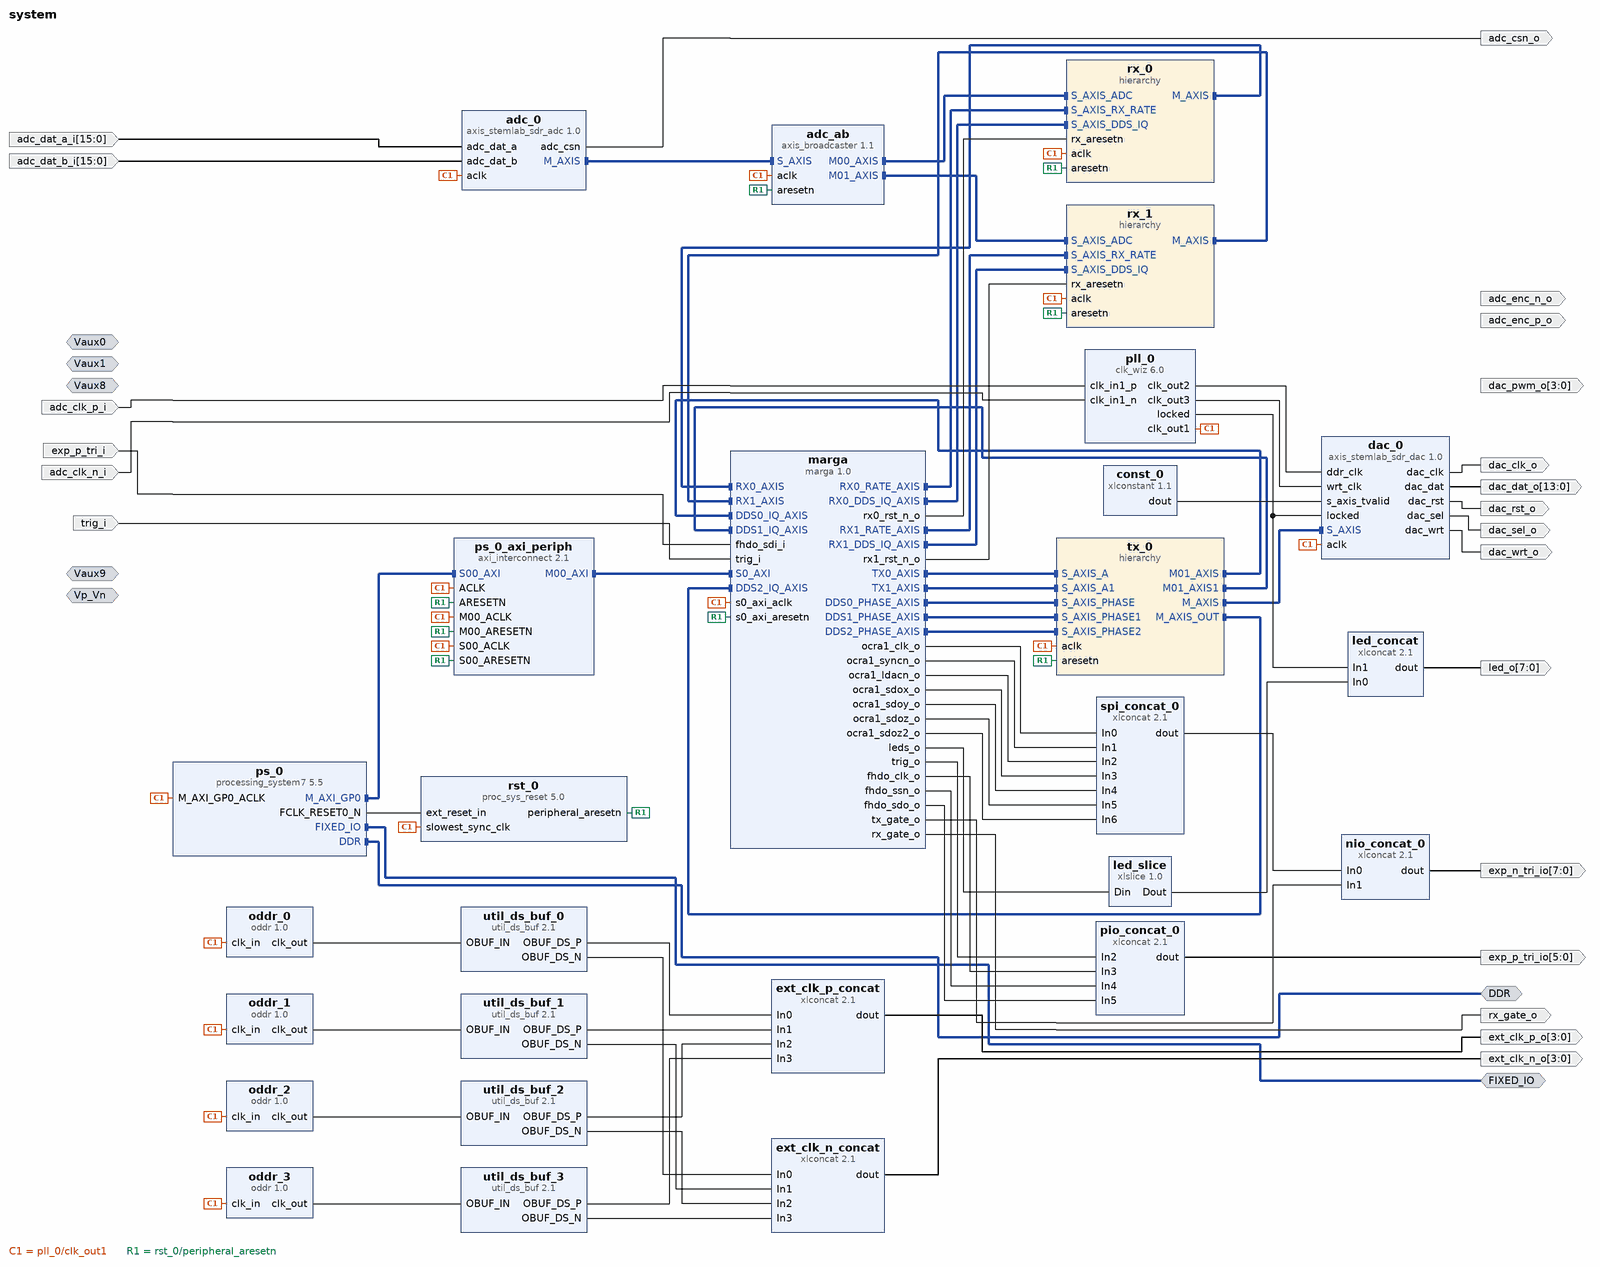
[diagram p0: block diagram of the top level]
# Vivado block design system, xc7z020clg400-1, Vivado 2020.2
create_bd_design system

create_bd_intf_port -mode Slave -vlnv xilinx.com:interface:diff_analog_io_rtl:1.0 Vp_Vn
create_bd_intf_port -mode Slave -vlnv xilinx.com:interface:diff_analog_io_rtl:1.0 Vaux0
create_bd_intf_port -mode Slave -vlnv xilinx.com:interface:diff_analog_io_rtl:1.0 Vaux1
create_bd_intf_port -mode Slave -vlnv xilinx.com:interface:diff_analog_io_rtl:1.0 Vaux9
create_bd_intf_port -mode Slave -vlnv xilinx.com:interface:diff_analog_io_rtl:1.0 Vaux8
create_bd_intf_port -mode Master -vlnv xilinx.com:interface:ddrx_rtl:1.0 DDR
create_bd_intf_port -mode Master -vlnv xilinx.com:display_processing_system7:fixedio_rtl:1.0 FIXED_IO
create_bd_port -dir I -from 15 -to 0 adc_dat_a_i
create_bd_port -dir I -from 15 -to 0 adc_dat_b_i
create_bd_port -dir I adc_clk_p_i
create_bd_port -dir I adc_clk_n_i
create_bd_port -dir O adc_enc_p_o
create_bd_port -dir O adc_enc_n_o
create_bd_port -dir O adc_csn_o
create_bd_port -dir O -from 13 -to 0 dac_dat_o
create_bd_port -dir O dac_clk_o
create_bd_port -dir O dac_rst_o
create_bd_port -dir O dac_sel_o
create_bd_port -dir O dac_wrt_o
create_bd_port -dir O -from 3 -to 0 dac_pwm_o
create_bd_port -dir O -from 5 -to 0 exp_p_tri_io
create_bd_port -dir I -type data exp_p_tri_i
create_bd_port -dir O -type data rx_gate_o
create_bd_port -dir O -from 7 -to 0 exp_n_tri_io
create_bd_port -dir I -type data trig_i
create_bd_port -dir O -from 7 -to 0 led_o
create_bd_port -dir O -from 3 -to 0 -type clk ext_clk_p_o
create_bd_port -dir O -from 3 -to 0 -type clk ext_clk_n_o

create_bd_cell -type ip -vlnv xilinx.com:ip:clk_wiz:6.0 pll_0
set_property -dict [list \
  CONFIG.CLKOUT1_REQUESTED_OUT_FREQ 122.88 \
  CONFIG.CLKOUT1_USED true \
  CONFIG.CLKOUT2_REQUESTED_OUT_FREQ 245.76 \
  CONFIG.CLKOUT2_REQUESTED_PHASE -112.5 \
  CONFIG.CLKOUT2_USED true \
  CONFIG.CLKOUT3_REQUESTED_OUT_FREQ 245.76 \
  CONFIG.CLKOUT3_REQUESTED_PHASE -67.5 \
  CONFIG.CLKOUT3_USED true \
  CONFIG.PRIMITIVE PLL \
  CONFIG.PRIM_IN_FREQ 122.88 \
  CONFIG.PRIM_SOURCE Differential_clock_capable_pin \
  CONFIG.USE_RESET false \
] [get_bd_cells pll_0]
create_bd_cell -type ip -vlnv xilinx.com:ip:oddr:1.0 oddr_0
create_bd_cell -type ip -vlnv xilinx.com:ip:oddr:1.0 oddr_1
create_bd_cell -type ip -vlnv xilinx.com:ip:oddr:1.0 oddr_2
create_bd_cell -type ip -vlnv xilinx.com:ip:oddr:1.0 oddr_3
create_bd_cell -type ip -vlnv xilinx.com:ip:util_ds_buf:2.1 util_ds_buf_0
set_property -dict {CONFIG.C_BUF_TYPE OBUFDS} [get_bd_cells util_ds_buf_0]
create_bd_cell -type ip -vlnv xilinx.com:ip:util_ds_buf:2.1 util_ds_buf_1
set_property -dict {CONFIG.C_BUF_TYPE OBUFDS} [get_bd_cells util_ds_buf_1]
create_bd_cell -type ip -vlnv xilinx.com:ip:util_ds_buf:2.1 util_ds_buf_2
set_property -dict {CONFIG.C_BUF_TYPE OBUFDS} [get_bd_cells util_ds_buf_2]
create_bd_cell -type ip -vlnv xilinx.com:ip:util_ds_buf:2.1 util_ds_buf_3
set_property -dict {CONFIG.C_BUF_TYPE OBUFDS} [get_bd_cells util_ds_buf_3]
create_bd_cell -type ip -vlnv xilinx.com:ip:xlconcat:2.1 ext_clk_p_concat
set_property -dict {CONFIG.NUM_PORTS 4} [get_bd_cells ext_clk_p_concat]
create_bd_cell -type ip -vlnv xilinx.com:ip:xlconcat:2.1 ext_clk_n_concat
set_property -dict {CONFIG.NUM_PORTS 4} [get_bd_cells ext_clk_n_concat]
create_bd_cell -type ip -vlnv xilinx.com:ip:processing_system7:5.5 ps_0
set_property -dict [list \
  CONFIG.PCW_APU_PERIPHERAL_FREQMHZ 666.666666 \
  CONFIG.PCW_ENET0_ENET0_IO {MIO 16 .. 27} \
  CONFIG.PCW_ENET0_GRP_MDIO_ENABLE 1 \
  CONFIG.PCW_ENET0_GRP_MDIO_IO {MIO 52 .. 53} \
  CONFIG.PCW_ENET0_PERIPHERAL_ENABLE 1 \
  CONFIG.PCW_ENET0_RESET_ENABLE 0 \
  CONFIG.PCW_ENET_RESET_ENABLE 1 \
  CONFIG.PCW_ENET_RESET_SELECT {Share reset pin} \
  CONFIG.PCW_FPGA0_PERIPHERAL_FREQMHZ 143 \
  CONFIG.PCW_FPGA1_PERIPHERAL_FREQMHZ 50 \
  CONFIG.PCW_GPIO_EMIO_GPIO_ENABLE 1 \
  CONFIG.PCW_GPIO_EMIO_GPIO_IO 64 \
  CONFIG.PCW_GPIO_MIO_GPIO_ENABLE 1 \
  CONFIG.PCW_GPIO_MIO_GPIO_IO MIO \
  CONFIG.PCW_GPIO_PERIPHERAL_ENABLE 1 \
  CONFIG.PCW_I2C0_GRP_INT_ENABLE 0 \
  CONFIG.PCW_I2C0_I2C0_IO {MIO 50 .. 51} \
  CONFIG.PCW_I2C0_PERIPHERAL_ENABLE 1 \
  CONFIG.PCW_I2C_PERIPHERAL_FREQMHZ 111.111115 \
  CONFIG.PCW_I2C_RESET_ENABLE 1 \
  CONFIG.PCW_I2C_RESET_SELECT {Share reset pin} \
  CONFIG.PCW_IMPORT_BOARD_PRESET cfg/stemlab_sdr.xml \
  CONFIG.PCW_PRESET_BANK1_VOLTAGE {LVCMOS 2.5V} \
  CONFIG.PCW_QSPI_GRP_SINGLE_SS_ENABLE 1 \
  CONFIG.PCW_QSPI_GRP_SINGLE_SS_IO {MIO 1 .. 6} \
  CONFIG.PCW_QSPI_PERIPHERAL_ENABLE 1 \
  CONFIG.PCW_QSPI_PERIPHERAL_FREQMHZ 125 \
  CONFIG.PCW_QSPI_QSPI_IO {MIO 1 .. 6} \
  CONFIG.PCW_SD0_GRP_CD_ENABLE 1 \
  CONFIG.PCW_SD0_GRP_CD_IO {MIO 46} \
  CONFIG.PCW_SD0_GRP_WP_ENABLE 1 \
  CONFIG.PCW_SD0_GRP_WP_IO {MIO 47} \
  CONFIG.PCW_SD0_PERIPHERAL_ENABLE 1 \
  CONFIG.PCW_SD0_SD0_IO {MIO 40 .. 45} \
  CONFIG.PCW_SDIO_PERIPHERAL_FREQMHZ 100 \
  CONFIG.PCW_SINGLE_QSPI_DATA_MODE x4 \
  CONFIG.PCW_SPI0_PERIPHERAL_ENABLE 1 \
  CONFIG.PCW_SPI0_SPI0_IO EMIO \
  CONFIG.PCW_SPI1_PERIPHERAL_ENABLE 1 \
  CONFIG.PCW_SPI1_SPI1_IO {MIO 10 .. 15} \
  CONFIG.PCW_TTC0_PERIPHERAL_ENABLE 1 \
  CONFIG.PCW_TTC0_TTC0_IO EMIO \
  CONFIG.PCW_UART0_PERIPHERAL_ENABLE 1 \
  CONFIG.PCW_UART0_UART0_IO {MIO 14 .. 15} \
  CONFIG.PCW_UART1_PERIPHERAL_ENABLE 1 \
  CONFIG.PCW_UART1_UART1_IO {MIO 8 .. 9} \
  CONFIG.PCW_UART_PERIPHERAL_FREQMHZ 100 \
  CONFIG.PCW_UIPARAM_DDR_BUS_WIDTH {16 Bit} \
  CONFIG.PCW_UIPARAM_DDR_FREQ_MHZ 533.333333 \
  CONFIG.PCW_UIPARAM_DDR_PARTNO {MT41J256M16 RE-125} \
  CONFIG.PCW_USB0_PERIPHERAL_ENABLE 1 \
  CONFIG.PCW_USB0_RESET_ENABLE 1 \
  CONFIG.PCW_USB0_RESET_IO {MIO 48} \
  CONFIG.PCW_USB0_USB0_IO {MIO 28 .. 39} \
  CONFIG.PCW_USB_RESET_ENABLE 1 \
  CONFIG.PCW_USB_RESET_SELECT {Share reset pin} \
] [get_bd_cells ps_0]
# 430 more settings of ps_0 are not shown: defaults, MIO pin electricals, DDR timing, and values the tool derives
create_bd_cell -type ip -vlnv xilinx.com:ip:proc_sys_reset:5.0 rst_0
create_bd_cell -type ip -vlnv xilinx.com:ip:xlconstant:1.1 const_0
create_bd_cell -type ip -vlnv pavel-demin:user:axis_stemlab_sdr_adc:1.0 adc_0
set_property -dict {CONFIG.ADC_DATA_WIDTH 16} [get_bd_cells adc_0]
create_bd_cell -type ip -vlnv pavel-demin:user:axis_stemlab_sdr_dac:1.0 dac_0
set_property -dict {CONFIG.DAC_DATA_WIDTH 14} [get_bd_cells dac_0]
create_bd_cell -type ip -vlnv xilinx.com:ip:axis_broadcaster:1.1 adc_ab
set_property -dict [list \
  CONFIG.HAS_TREADY 0 \
  CONFIG.M00_TDATA_REMAP {tdata[15:0]} \
  CONFIG.M01_TDATA_REMAP {tdata[31:16]} \
  CONFIG.M_TDATA_NUM_BYTES 2 \
  CONFIG.S_TDATA_NUM_BYTES 4 \
] [get_bd_cells adc_ab]
create_bd_cell -type ip -vlnv open-mri:user:marga:1.0 marga
set_property -dict {CONFIG.C_S0_AXI_ADDR_WIDTH 19 CONFIG.RX_FIFO_LENGTH 16384} [get_bd_cells marga]
create_bd_cell -type ip -vlnv xilinx.com:ip:axi_interconnect:2.1 ps_0_axi_periph
set_property -dict {CONFIG.NUM_MI 1} [get_bd_cells ps_0_axi_periph]
create_bd_cell -type hier rx_0
create_bd_cell -type hier rx_1
create_bd_cell -type hier tx_0
create_bd_cell -type ip -vlnv xilinx.com:ip:xlslice:1.0 led_slice
set_property -dict {CONFIG.DIN_FROM 6 CONFIG.DIN_TO 0 CONFIG.DIN_WIDTH 8} [get_bd_cells led_slice]
create_bd_cell -type ip -vlnv xilinx.com:ip:xlconcat:2.1 led_concat
set_property -dict {CONFIG.IN0_WIDTH 7 CONFIG.IN1_WIDTH 1 CONFIG.NUM_PORTS 2} [get_bd_cells led_concat]
create_bd_cell -type ip -vlnv xilinx.com:ip:xlconcat:2.1 spi_concat_0
set_property -dict {CONFIG.NUM_PORTS 7} [get_bd_cells spi_concat_0]
create_bd_cell -type ip -vlnv xilinx.com:ip:xlconcat:2.1 pio_concat_0
set_property -dict {CONFIG.NUM_PORTS 6} [get_bd_cells pio_concat_0]
create_bd_cell -type ip -vlnv xilinx.com:ip:xlconcat:2.1 nio_concat_0
set_property -dict {CONFIG.NUM_PORTS 2} [get_bd_cells nio_concat_0]

# ---- hierarchy /rx_0 ----
current_bd_instance /rx_0
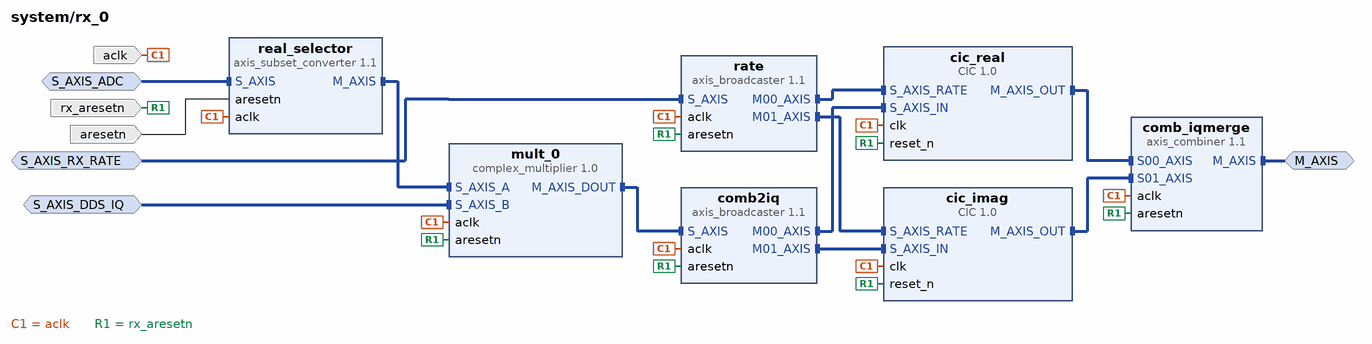
[diagram p1: block diagram inside /rx_0]
create_bd_intf_pin -mode Slave -vlnv xilinx.com:interface:axis_rtl:1.0 S_AXIS_ADC
create_bd_intf_pin -mode Slave -vlnv xilinx.com:interface:axis_rtl:1.0 S_AXIS_DDS_IQ
create_bd_intf_pin -mode Slave -vlnv xilinx.com:interface:axis_rtl:1.0 S_AXIS_RX_RATE
create_bd_intf_pin -mode Master -vlnv xilinx.com:interface:axis_rtl:1.0 M_AXIS
create_bd_pin -dir I rx_aresetn
create_bd_pin -dir I -type clk aclk
create_bd_pin -dir I -type rst aresetn

create_bd_cell -type ip -vlnv xilinx.com:ip:axis_subset_converter:1.1 real_selector
set_property -dict [list \
  CONFIG.M_TDATA_NUM_BYTES 4 \
  CONFIG.S_TDATA_NUM_BYTES 2 \
  CONFIG.TDATA_REMAP {16'b0, tdata[15:0]} \
] [get_bd_cells real_selector]
create_bd_cell -type ip -vlnv open-mri:user:complex_multiplier:1.0 mult_0
set_property -dict [list \
  CONFIG.BLOCKING 0 \
  CONFIG.OPERAND_WIDTH_A 16 \
  CONFIG.OPERAND_WIDTH_B 16 \
  CONFIG.OPERAND_WIDTH_OUT 32 \
  CONFIG.ROUND_MODE 1 \
  CONFIG.STAGES 6 \
] [get_bd_cells mult_0]
create_bd_cell -type ip -vlnv xilinx.com:ip:axis_broadcaster:1.1 comb2iq
set_property -dict [list \
  CONFIG.HAS_TREADY 0 \
  CONFIG.M00_TDATA_REMAP {tdata[31:0]} \
  CONFIG.M01_TDATA_REMAP {tdata[63:32]} \
  CONFIG.M_TDATA_NUM_BYTES 4 \
  CONFIG.S_TDATA_NUM_BYTES 8 \
] [get_bd_cells comb2iq]
create_bd_cell -type ip -vlnv xilinx.com:ip:axis_broadcaster:1.1 rate
set_property -dict [list \
  CONFIG.HAS_TREADY 0 \
  CONFIG.M00_TDATA_REMAP {tdata[15:0]} \
  CONFIG.M01_TDATA_REMAP {tdata[15:0]} \
  CONFIG.M_TDATA_NUM_BYTES 2 \
  CONFIG.S_TDATA_NUM_BYTES 2 \
] [get_bd_cells rate]
create_bd_cell -type ip -vlnv open-mri:user:CIC:1.0 cic_real
set_property -dict [list \
  CONFIG.CIC_M 1 \
  CONFIG.CIC_N 6 \
  CONFIG.CIC_R 4095 \
  CONFIG.EXACT_SCALING 0 \
  CONFIG.INP_DW 32 \
  CONFIG.OUT_DW 32 \
  CONFIG.PRG_SCALING 1 \
  CONFIG.PRUNE_BITS 0x0000000000000000000000480000004500000044000000440000004300000042000000410000003C00000031000000270000001C000000100000000400000000 \
  CONFIG.RATE_DW 16 \
  CONFIG.VAR_RATE 1 \
] [get_bd_cells cic_real]
create_bd_cell -type ip -vlnv open-mri:user:CIC:1.0 cic_imag
set_property -dict [list \
  CONFIG.CIC_M 1 \
  CONFIG.CIC_N 6 \
  CONFIG.CIC_R 4095 \
  CONFIG.EXACT_SCALING 0 \
  CONFIG.INP_DW 32 \
  CONFIG.OUT_DW 32 \
  CONFIG.PRG_SCALING 1 \
  CONFIG.PRUNE_BITS 0x0000000000000000000000480000004500000044000000440000004300000042000000410000003C00000031000000270000001C000000100000000400000000 \
  CONFIG.RATE_DW 16 \
  CONFIG.VAR_RATE 1 \
] [get_bd_cells cic_imag]
create_bd_cell -type ip -vlnv xilinx.com:ip:axis_combiner:1.1 comb_iqmerge
set_property -dict {CONFIG.NUM_SI 2 CONFIG.TDATA_NUM_BYTES 4} [get_bd_cells comb_iqmerge]

# ---- hierarchy /rx_1 ----
current_bd_instance /rx_1
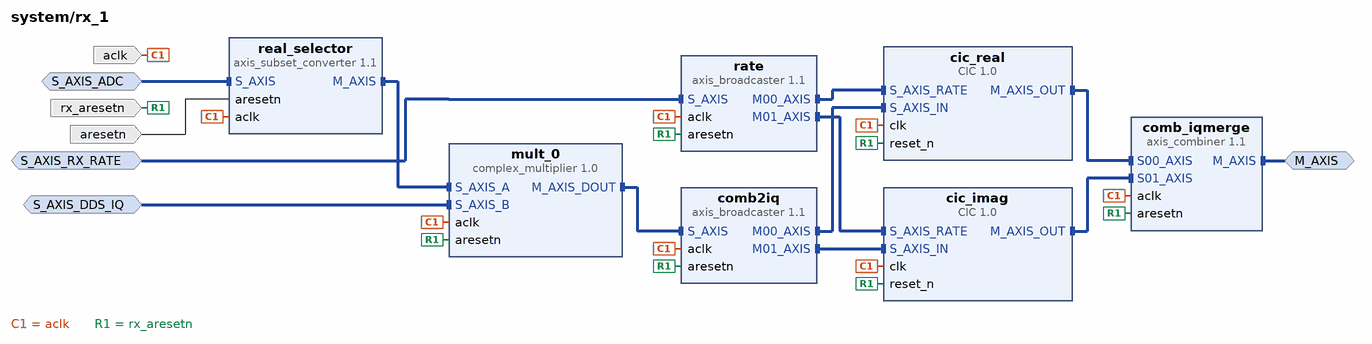
[diagram p2: block diagram inside /rx_1]
create_bd_intf_pin -mode Slave -vlnv xilinx.com:interface:axis_rtl:1.0 S_AXIS_ADC
create_bd_intf_pin -mode Slave -vlnv xilinx.com:interface:axis_rtl:1.0 S_AXIS_DDS_IQ
create_bd_intf_pin -mode Slave -vlnv xilinx.com:interface:axis_rtl:1.0 S_AXIS_RX_RATE
create_bd_intf_pin -mode Master -vlnv xilinx.com:interface:axis_rtl:1.0 M_AXIS
create_bd_pin -dir I rx_aresetn
create_bd_pin -dir I -type clk aclk
create_bd_pin -dir I -type rst aresetn

create_bd_cell -type ip -vlnv xilinx.com:ip:axis_subset_converter:1.1 real_selector
set_property -dict [list \
  CONFIG.M_TDATA_NUM_BYTES 4 \
  CONFIG.S_TDATA_NUM_BYTES 2 \
  CONFIG.TDATA_REMAP {16'b0, tdata[15:0]} \
] [get_bd_cells real_selector]
create_bd_cell -type ip -vlnv open-mri:user:complex_multiplier:1.0 mult_0
set_property -dict [list \
  CONFIG.BLOCKING 0 \
  CONFIG.OPERAND_WIDTH_A 16 \
  CONFIG.OPERAND_WIDTH_B 16 \
  CONFIG.OPERAND_WIDTH_OUT 32 \
  CONFIG.ROUND_MODE 1 \
  CONFIG.STAGES 6 \
] [get_bd_cells mult_0]
create_bd_cell -type ip -vlnv xilinx.com:ip:axis_broadcaster:1.1 comb2iq
set_property -dict [list \
  CONFIG.HAS_TREADY 0 \
  CONFIG.M00_TDATA_REMAP {tdata[31:0]} \
  CONFIG.M01_TDATA_REMAP {tdata[63:32]} \
  CONFIG.M_TDATA_NUM_BYTES 4 \
  CONFIG.S_TDATA_NUM_BYTES 8 \
] [get_bd_cells comb2iq]
create_bd_cell -type ip -vlnv xilinx.com:ip:axis_broadcaster:1.1 rate
set_property -dict [list \
  CONFIG.HAS_TREADY 0 \
  CONFIG.M00_TDATA_REMAP {tdata[15:0]} \
  CONFIG.M01_TDATA_REMAP {tdata[15:0]} \
  CONFIG.M_TDATA_NUM_BYTES 2 \
  CONFIG.S_TDATA_NUM_BYTES 2 \
] [get_bd_cells rate]
create_bd_cell -type ip -vlnv open-mri:user:CIC:1.0 cic_real
set_property -dict [list \
  CONFIG.CIC_M 1 \
  CONFIG.CIC_N 6 \
  CONFIG.CIC_R 4095 \
  CONFIG.EXACT_SCALING 0 \
  CONFIG.INP_DW 32 \
  CONFIG.OUT_DW 32 \
  CONFIG.PRG_SCALING 1 \
  CONFIG.PRUNE_BITS 0x0000000000000000000000480000004500000044000000440000004300000042000000410000003C00000031000000270000001C000000100000000400000000 \
  CONFIG.RATE_DW 16 \
  CONFIG.VAR_RATE 1 \
] [get_bd_cells cic_real]
create_bd_cell -type ip -vlnv open-mri:user:CIC:1.0 cic_imag
set_property -dict [list \
  CONFIG.CIC_M 1 \
  CONFIG.CIC_N 6 \
  CONFIG.CIC_R 4095 \
  CONFIG.EXACT_SCALING 0 \
  CONFIG.INP_DW 32 \
  CONFIG.OUT_DW 32 \
  CONFIG.PRG_SCALING 1 \
  CONFIG.PRUNE_BITS 0x0000000000000000000000480000004500000044000000440000004300000042000000410000003C00000031000000270000001C000000100000000400000000 \
  CONFIG.RATE_DW 16 \
  CONFIG.VAR_RATE 1 \
] [get_bd_cells cic_imag]
create_bd_cell -type ip -vlnv xilinx.com:ip:axis_combiner:1.1 comb_iqmerge
set_property -dict {CONFIG.NUM_SI 2 CONFIG.TDATA_NUM_BYTES 4} [get_bd_cells comb_iqmerge]

# ---- hierarchy /tx_0 ----
current_bd_instance /tx_0
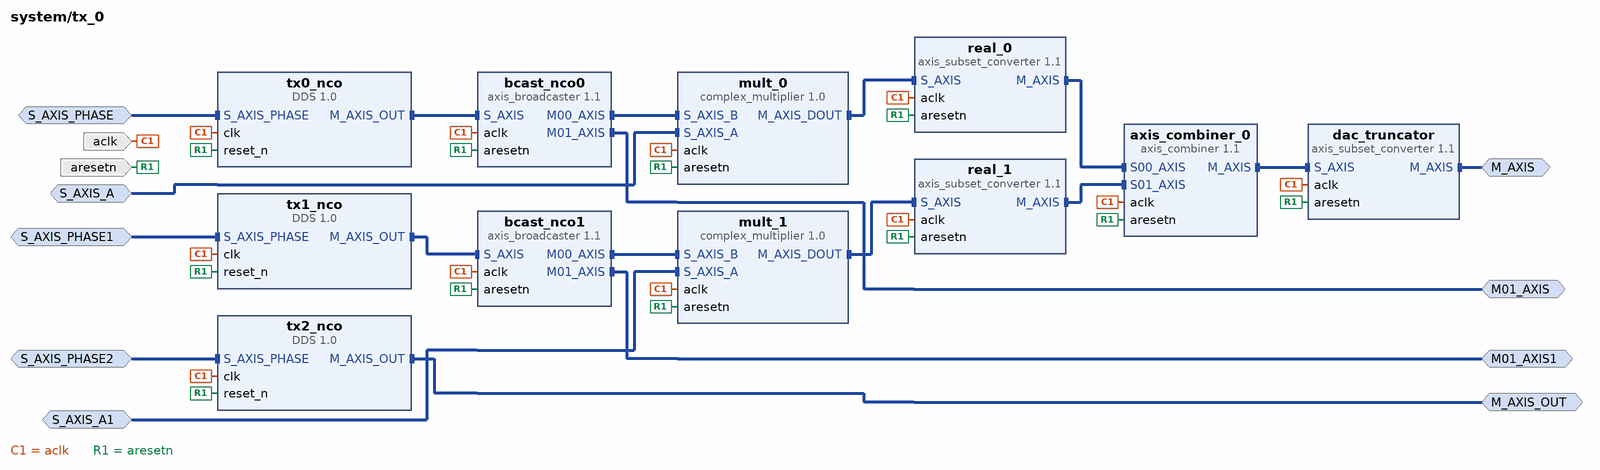
[diagram p3: block diagram inside /tx_0]
create_bd_intf_pin -mode Slave -vlnv xilinx.com:interface:axis_rtl:1.0 S_AXIS_A
create_bd_intf_pin -mode Slave -vlnv xilinx.com:interface:axis_rtl:1.0 S_AXIS_A1
create_bd_intf_pin -mode Master -vlnv xilinx.com:interface:axis_rtl:1.0 M_AXIS
create_bd_intf_pin -mode Slave -vlnv xilinx.com:interface:axis_rtl:1.0 S_AXIS_PHASE
create_bd_intf_pin -mode Slave -vlnv xilinx.com:interface:axis_rtl:1.0 S_AXIS_PHASE1
create_bd_intf_pin -mode Slave -vlnv xilinx.com:interface:axis_rtl:1.0 S_AXIS_PHASE2
create_bd_intf_pin -mode Master -vlnv xilinx.com:interface:axis_rtl:1.0 M01_AXIS
create_bd_intf_pin -mode Master -vlnv xilinx.com:interface:axis_rtl:1.0 M01_AXIS1
create_bd_intf_pin -mode Master -vlnv xilinx.com:interface:axis_rtl:1.0 M_AXIS_OUT
create_bd_pin -dir I -type clk aclk
create_bd_pin -dir I -type rst aresetn

create_bd_cell -type ip -vlnv open-mri:user:complex_multiplier:1.0 mult_0
set_property -dict [list \
  CONFIG.BLOCKING 0 \
  CONFIG.OPERAND_WIDTH_A 16 \
  CONFIG.OPERAND_WIDTH_B 16 \
  CONFIG.OPERAND_WIDTH_OUT 16 \
  CONFIG.ROUND_MODE 1 \
  CONFIG.STAGES 6 \
] [get_bd_cells mult_0]
create_bd_cell -type ip -vlnv open-mri:user:complex_multiplier:1.0 mult_1
set_property -dict [list \
  CONFIG.BLOCKING 0 \
  CONFIG.OPERAND_WIDTH_A 16 \
  CONFIG.OPERAND_WIDTH_B 16 \
  CONFIG.OPERAND_WIDTH_OUT 16 \
  CONFIG.ROUND_MODE 1 \
  CONFIG.STAGES 6 \
] [get_bd_cells mult_1]
create_bd_cell -type ip -vlnv xilinx.com:ip:axis_subset_converter:1.1 real_0
set_property -dict {CONFIG.M_TDATA_NUM_BYTES 2 CONFIG.S_TDATA_NUM_BYTES 4 CONFIG.TDATA_REMAP {tdata[15:0]}} [get_bd_cells real_0]
create_bd_cell -type ip -vlnv xilinx.com:ip:axis_subset_converter:1.1 real_1
set_property -dict {CONFIG.M_TDATA_NUM_BYTES 2 CONFIG.S_TDATA_NUM_BYTES 4 CONFIG.TDATA_REMAP {tdata[15:0]}} [get_bd_cells real_1]
create_bd_cell -type ip -vlnv xilinx.com:ip:axis_combiner:1.1 axis_combiner_0
set_property -dict {CONFIG.NUM_SI 2 CONFIG.TDATA_NUM_BYTES 2} [get_bd_cells axis_combiner_0]
create_bd_cell -type ip -vlnv xilinx.com:ip:axis_subset_converter:1.1 dac_truncator
set_property -dict [list \
  CONFIG.M_TDATA_NUM_BYTES 4 \
  CONFIG.S_TDATA_NUM_BYTES 4 \
  CONFIG.TDATA_REMAP {2'b00, tdata[30:17], 2'b00, tdata[14:1]} \
] [get_bd_cells dac_truncator]
create_bd_cell -type ip -vlnv open-mri:user:DDS:1.0 tx0_nco
set_property -dict [list \
  CONFIG.LUT_DW 9 \
  CONFIG.NEGATIVE_SINE 1 \
  CONFIG.OUT_DW 16 \
  CONFIG.PHASE_DW 24 \
  CONFIG.SIN_COS 1 \
  CONFIG.USE_TAYLOR 1 \
] [get_bd_cells tx0_nco]
create_bd_cell -type ip -vlnv open-mri:user:DDS:1.0 tx1_nco
set_property -dict [list \
  CONFIG.LUT_DW 9 \
  CONFIG.NEGATIVE_SINE 1 \
  CONFIG.OUT_DW 16 \
  CONFIG.PHASE_DW 24 \
  CONFIG.SIN_COS 1 \
  CONFIG.USE_TAYLOR 1 \
] [get_bd_cells tx1_nco]
create_bd_cell -type ip -vlnv open-mri:user:DDS:1.0 tx2_nco
set_property -dict [list \
  CONFIG.LUT_DW 9 \
  CONFIG.NEGATIVE_SINE 1 \
  CONFIG.OUT_DW 16 \
  CONFIG.PHASE_DW 24 \
  CONFIG.SIN_COS 1 \
  CONFIG.USE_TAYLOR 1 \
] [get_bd_cells tx2_nco]
create_bd_cell -type ip -vlnv xilinx.com:ip:axis_broadcaster:1.1 bcast_nco0
set_property -dict [list \
  CONFIG.HAS_TREADY 0 \
  CONFIG.M00_TDATA_REMAP {tdata[31:0]} \
  CONFIG.M01_TDATA_REMAP {tdata[31:0]} \
  CONFIG.M_TDATA_NUM_BYTES 4 \
  CONFIG.NUM_MI 2 \
  CONFIG.S_TDATA_NUM_BYTES 4 \
] [get_bd_cells bcast_nco0]
create_bd_cell -type ip -vlnv xilinx.com:ip:axis_broadcaster:1.1 bcast_nco1
set_property -dict [list \
  CONFIG.HAS_TREADY 0 \
  CONFIG.M00_TDATA_REMAP {tdata[31:0]} \
  CONFIG.M01_TDATA_REMAP {tdata[31:0]} \
  CONFIG.M_TDATA_NUM_BYTES 4 \
  CONFIG.NUM_MI 2 \
  CONFIG.S_TDATA_NUM_BYTES 4 \
] [get_bd_cells bcast_nco1]

# ---- connections ----

current_bd_instance /rx_0
connect_bd_intf_net [get_bd_intf_pins cic_real/S_AXIS_RATE] [get_bd_intf_pins rate/M00_AXIS]
connect_bd_intf_net [get_bd_intf_pins S_AXIS_ADC] [get_bd_intf_pins real_selector/S_AXIS]
connect_bd_intf_net [get_bd_intf_pins mult_0/S_AXIS_A] [get_bd_intf_pins real_selector/M_AXIS]
connect_bd_intf_net [get_bd_intf_pins S_AXIS_DDS_IQ] [get_bd_intf_pins mult_0/S_AXIS_B]
connect_bd_intf_net [get_bd_intf_pins comb2iq/S_AXIS] [get_bd_intf_pins mult_0/M_AXIS_DOUT]
connect_bd_intf_net [get_bd_intf_pins S_AXIS_RX_RATE] [get_bd_intf_pins rate/S_AXIS]
connect_bd_intf_net [get_bd_intf_pins cic_real/S_AXIS_IN] [get_bd_intf_pins comb2iq/M00_AXIS]
connect_bd_intf_net [get_bd_intf_pins cic_imag/S_AXIS_RATE] [get_bd_intf_pins rate/M01_AXIS]
connect_bd_intf_net [get_bd_intf_pins cic_imag/S_AXIS_IN] [get_bd_intf_pins comb2iq/M01_AXIS]
connect_bd_intf_net [get_bd_intf_pins comb_iqmerge/S00_AXIS] [get_bd_intf_pins cic_real/M_AXIS_OUT]
connect_bd_intf_net [get_bd_intf_pins comb_iqmerge/S01_AXIS] [get_bd_intf_pins cic_imag/M_AXIS_OUT]
connect_bd_intf_net [get_bd_intf_pins M_AXIS] [get_bd_intf_pins comb_iqmerge/M_AXIS]
connect_bd_net [get_bd_pins aclk] \
  [get_bd_pins real_selector/aclk] [get_bd_pins mult_0/aclk] [get_bd_pins comb2iq/aclk] [get_bd_pins rate/aclk] \
  [get_bd_pins cic_real/clk] [get_bd_pins cic_imag/clk] [get_bd_pins comb_iqmerge/aclk]
connect_bd_net [get_bd_pins aresetn] [get_bd_pins real_selector/aresetn]
connect_bd_net [get_bd_pins rx_aresetn] \
  [get_bd_pins mult_0/aresetn] [get_bd_pins comb2iq/aresetn] [get_bd_pins rate/aresetn] [get_bd_pins cic_real/reset_n] \
  [get_bd_pins cic_imag/reset_n] [get_bd_pins comb_iqmerge/aresetn]

current_bd_instance /rx_1
connect_bd_intf_net [get_bd_intf_pins S_AXIS_ADC] [get_bd_intf_pins real_selector/S_AXIS]
connect_bd_intf_net [get_bd_intf_pins mult_0/S_AXIS_A] [get_bd_intf_pins real_selector/M_AXIS]
connect_bd_intf_net [get_bd_intf_pins S_AXIS_DDS_IQ] [get_bd_intf_pins mult_0/S_AXIS_B]
connect_bd_intf_net [get_bd_intf_pins comb2iq/S_AXIS] [get_bd_intf_pins mult_0/M_AXIS_DOUT]
connect_bd_intf_net [get_bd_intf_pins S_AXIS_RX_RATE] [get_bd_intf_pins rate/S_AXIS]
connect_bd_intf_net [get_bd_intf_pins cic_real/S_AXIS_RATE] [get_bd_intf_pins rate/M00_AXIS]
connect_bd_intf_net [get_bd_intf_pins cic_real/S_AXIS_IN] [get_bd_intf_pins comb2iq/M00_AXIS]
connect_bd_intf_net [get_bd_intf_pins cic_imag/S_AXIS_RATE] [get_bd_intf_pins rate/M01_AXIS]
connect_bd_intf_net [get_bd_intf_pins cic_imag/S_AXIS_IN] [get_bd_intf_pins comb2iq/M01_AXIS]
connect_bd_intf_net [get_bd_intf_pins comb_iqmerge/S00_AXIS] [get_bd_intf_pins cic_real/M_AXIS_OUT]
connect_bd_intf_net [get_bd_intf_pins comb_iqmerge/S01_AXIS] [get_bd_intf_pins cic_imag/M_AXIS_OUT]
connect_bd_intf_net [get_bd_intf_pins M_AXIS] [get_bd_intf_pins comb_iqmerge/M_AXIS]
connect_bd_net [get_bd_pins aclk] \
  [get_bd_pins real_selector/aclk] [get_bd_pins mult_0/aclk] [get_bd_pins comb2iq/aclk] [get_bd_pins rate/aclk] \
  [get_bd_pins cic_real/clk] [get_bd_pins cic_imag/clk] [get_bd_pins comb_iqmerge/aclk]
connect_bd_net [get_bd_pins aresetn] [get_bd_pins real_selector/aresetn]
connect_bd_net [get_bd_pins rx_aresetn] \
  [get_bd_pins mult_0/aresetn] [get_bd_pins comb2iq/aresetn] [get_bd_pins rate/aresetn] [get_bd_pins cic_real/reset_n] \
  [get_bd_pins cic_imag/reset_n] [get_bd_pins comb_iqmerge/aresetn]

current_bd_instance /tx_0
connect_bd_intf_net [get_bd_intf_pins M01_AXIS1] [get_bd_intf_pins bcast_nco1/M01_AXIS]
connect_bd_intf_net [get_bd_intf_pins S_AXIS_A] [get_bd_intf_pins mult_0/S_AXIS_A]
connect_bd_intf_net [get_bd_intf_pins S_AXIS_A1] [get_bd_intf_pins mult_1/S_AXIS_A]
connect_bd_intf_net [get_bd_intf_pins real_0/S_AXIS] [get_bd_intf_pins mult_0/M_AXIS_DOUT]
connect_bd_intf_net [get_bd_intf_pins real_1/S_AXIS] [get_bd_intf_pins mult_1/M_AXIS_DOUT]
connect_bd_intf_net [get_bd_intf_pins axis_combiner_0/S00_AXIS] [get_bd_intf_pins real_0/M_AXIS]
connect_bd_intf_net [get_bd_intf_pins axis_combiner_0/S01_AXIS] [get_bd_intf_pins real_1/M_AXIS]
connect_bd_intf_net [get_bd_intf_pins M_AXIS] [get_bd_intf_pins dac_truncator/M_AXIS]
connect_bd_intf_net [get_bd_intf_pins dac_truncator/S_AXIS] [get_bd_intf_pins axis_combiner_0/M_AXIS]
connect_bd_intf_net [get_bd_intf_pins S_AXIS_PHASE] [get_bd_intf_pins tx0_nco/S_AXIS_PHASE]
connect_bd_intf_net [get_bd_intf_pins S_AXIS_PHASE1] [get_bd_intf_pins tx1_nco/S_AXIS_PHASE]
connect_bd_intf_net [get_bd_intf_pins S_AXIS_PHASE2] [get_bd_intf_pins tx2_nco/S_AXIS_PHASE]
connect_bd_intf_net [get_bd_intf_pins bcast_nco0/M00_AXIS] [get_bd_intf_pins mult_0/S_AXIS_B]
connect_bd_intf_net [get_bd_intf_pins bcast_nco0/S_AXIS] [get_bd_intf_pins tx0_nco/M_AXIS_OUT]
connect_bd_intf_net [get_bd_intf_pins bcast_nco1/M00_AXIS] [get_bd_intf_pins mult_1/S_AXIS_B]
connect_bd_intf_net [get_bd_intf_pins bcast_nco1/S_AXIS] [get_bd_intf_pins tx1_nco/M_AXIS_OUT]
connect_bd_intf_net [get_bd_intf_pins M01_AXIS] [get_bd_intf_pins bcast_nco0/M01_AXIS]
connect_bd_intf_net [get_bd_intf_pins M_AXIS_OUT] [get_bd_intf_pins tx2_nco/M_AXIS_OUT]
connect_bd_net [get_bd_pins aclk] \
  [get_bd_pins mult_0/aclk] [get_bd_pins mult_1/aclk] [get_bd_pins real_0/aclk] [get_bd_pins real_1/aclk] \
  [get_bd_pins axis_combiner_0/aclk] [get_bd_pins dac_truncator/aclk] [get_bd_pins tx0_nco/clk] [get_bd_pins tx1_nco/clk] \
  [get_bd_pins tx2_nco/clk] [get_bd_pins bcast_nco0/aclk] [get_bd_pins bcast_nco1/aclk]
connect_bd_net [get_bd_pins aresetn] \
  [get_bd_pins mult_0/aresetn] [get_bd_pins mult_1/aresetn] [get_bd_pins real_0/aresetn] [get_bd_pins real_1/aresetn] \
  [get_bd_pins axis_combiner_0/aresetn] [get_bd_pins dac_truncator/aresetn] [get_bd_pins tx0_nco/reset_n] \
  [get_bd_pins tx1_nco/reset_n] [get_bd_pins tx2_nco/reset_n] [get_bd_pins bcast_nco0/aresetn] \
  [get_bd_pins bcast_nco1/aresetn]

current_bd_instance /
connect_bd_intf_net [get_bd_intf_pins marga/DDS0_IQ_AXIS] [get_bd_intf_pins tx_0/M01_AXIS]
connect_bd_intf_net [get_bd_intf_ports FIXED_IO] [get_bd_intf_pins ps_0/FIXED_IO]
connect_bd_intf_net [get_bd_intf_ports DDR] [get_bd_intf_pins ps_0/DDR]
connect_bd_intf_net [get_bd_intf_pins ps_0/M_AXI_GP0] [get_bd_intf_pins ps_0_axi_periph/S00_AXI]
connect_bd_intf_net [get_bd_intf_pins adc_ab/S_AXIS] [get_bd_intf_pins adc_0/M_AXIS]
connect_bd_intf_net [get_bd_intf_pins ps_0_axi_periph/M00_AXI] [get_bd_intf_pins marga/S0_AXI]
connect_bd_intf_net [get_bd_intf_pins rx_0/S_AXIS_ADC] [get_bd_intf_pins adc_ab/M00_AXIS]
connect_bd_intf_net [get_bd_intf_pins marga/RX0_AXIS] [get_bd_intf_pins rx_0/M_AXIS]
connect_bd_intf_net [get_bd_intf_pins rx_0/S_AXIS_RX_RATE] [get_bd_intf_pins marga/RX0_RATE_AXIS]
connect_bd_intf_net [get_bd_intf_pins rx_0/S_AXIS_DDS_IQ] [get_bd_intf_pins marga/RX0_DDS_IQ_AXIS]
connect_bd_intf_net [get_bd_intf_pins rx_1/S_AXIS_ADC] [get_bd_intf_pins adc_ab/M01_AXIS]
connect_bd_intf_net [get_bd_intf_pins marga/RX1_AXIS] [get_bd_intf_pins rx_1/M_AXIS]
connect_bd_intf_net [get_bd_intf_pins rx_1/S_AXIS_RX_RATE] [get_bd_intf_pins marga/RX1_RATE_AXIS]
connect_bd_intf_net [get_bd_intf_pins rx_1/S_AXIS_DDS_IQ] [get_bd_intf_pins marga/RX1_DDS_IQ_AXIS]
connect_bd_intf_net [get_bd_intf_pins marga/TX0_AXIS] [get_bd_intf_pins tx_0/S_AXIS_A]
connect_bd_intf_net [get_bd_intf_pins marga/TX1_AXIS] [get_bd_intf_pins tx_0/S_AXIS_A1]
connect_bd_intf_net [get_bd_intf_pins dac_0/S_AXIS] [get_bd_intf_pins tx_0/M_AXIS]
connect_bd_intf_net [get_bd_intf_pins marga/DDS0_PHASE_AXIS] [get_bd_intf_pins tx_0/S_AXIS_PHASE]
connect_bd_intf_net [get_bd_intf_pins marga/DDS1_PHASE_AXIS] [get_bd_intf_pins tx_0/S_AXIS_PHASE1]
connect_bd_intf_net [get_bd_intf_pins marga/DDS2_PHASE_AXIS] [get_bd_intf_pins tx_0/S_AXIS_PHASE2]
connect_bd_intf_net [get_bd_intf_pins marga/DDS1_IQ_AXIS] [get_bd_intf_pins tx_0/M01_AXIS1]
connect_bd_intf_net [get_bd_intf_pins marga/DDS2_IQ_AXIS] [get_bd_intf_pins tx_0/M_AXIS_OUT]
connect_bd_net [get_bd_ports adc_clk_p_i] [get_bd_pins pll_0/clk_in1_p]
connect_bd_net [get_bd_ports adc_clk_n_i] [get_bd_pins pll_0/clk_in1_n]
connect_bd_net [get_bd_pins pll_0/clk_out1] \
  [get_bd_pins oddr_0/clk_in] [get_bd_pins oddr_1/clk_in] [get_bd_pins oddr_2/clk_in] [get_bd_pins oddr_3/clk_in] \
  [get_bd_pins ps_0/M_AXI_GP0_ACLK] [get_bd_pins rst_0/slowest_sync_clk] [get_bd_pins adc_0/aclk] [get_bd_pins dac_0/aclk] \
  [get_bd_pins adc_ab/aclk] [get_bd_pins marga/s0_axi_aclk] [get_bd_pins ps_0_axi_periph/S00_ACLK] \
  [get_bd_pins ps_0_axi_periph/M00_ACLK] [get_bd_pins ps_0_axi_periph/ACLK] [get_bd_pins rx_0/aclk] [get_bd_pins rx_1/aclk] \
  [get_bd_pins tx_0/aclk]
connect_bd_net [get_bd_pins oddr_0/clk_out] [get_bd_pins util_ds_buf_0/OBUF_IN]
connect_bd_net [get_bd_pins oddr_1/clk_out] [get_bd_pins util_ds_buf_1/OBUF_IN]
connect_bd_net [get_bd_pins oddr_2/clk_out] [get_bd_pins util_ds_buf_2/OBUF_IN]
connect_bd_net [get_bd_pins oddr_3/clk_out] [get_bd_pins util_ds_buf_3/OBUF_IN]
connect_bd_net [get_bd_pins util_ds_buf_0/OBUF_DS_P] [get_bd_pins ext_clk_p_concat/In0]
connect_bd_net [get_bd_pins util_ds_buf_1/OBUF_DS_P] [get_bd_pins ext_clk_p_concat/In1]
connect_bd_net [get_bd_pins util_ds_buf_2/OBUF_DS_P] [get_bd_pins ext_clk_p_concat/In2]
connect_bd_net [get_bd_pins util_ds_buf_3/OBUF_DS_P] [get_bd_pins ext_clk_p_concat/In3]
connect_bd_net [get_bd_pins util_ds_buf_0/OBUF_DS_N] [get_bd_pins ext_clk_n_concat/In0]
connect_bd_net [get_bd_pins util_ds_buf_1/OBUF_DS_N] [get_bd_pins ext_clk_n_concat/In1]
connect_bd_net [get_bd_pins util_ds_buf_2/OBUF_DS_N] [get_bd_pins ext_clk_n_concat/In2]
connect_bd_net [get_bd_pins util_ds_buf_3/OBUF_DS_N] [get_bd_pins ext_clk_n_concat/In3]
connect_bd_net [get_bd_pins ext_clk_p_concat/dout] [get_bd_ports ext_clk_p_o]
connect_bd_net [get_bd_pins ext_clk_n_concat/dout] [get_bd_ports ext_clk_n_o]
connect_bd_net [get_bd_pins ps_0/FCLK_RESET0_N] [get_bd_pins rst_0/ext_reset_in]
connect_bd_net [get_bd_ports adc_dat_a_i] [get_bd_pins adc_0/adc_dat_a]
connect_bd_net [get_bd_ports adc_dat_b_i] [get_bd_pins adc_0/adc_dat_b]
connect_bd_net [get_bd_pins adc_0/adc_csn] [get_bd_ports adc_csn_o]
connect_bd_net [get_bd_pins pll_0/clk_out2] [get_bd_pins dac_0/ddr_clk]
connect_bd_net [get_bd_pins pll_0/clk_out3] [get_bd_pins dac_0/wrt_clk]
connect_bd_net [get_bd_pins pll_0/locked] [get_bd_pins dac_0/locked] [get_bd_pins led_concat/In1]
connect_bd_net [get_bd_pins dac_0/dac_clk] [get_bd_ports dac_clk_o]
connect_bd_net [get_bd_pins dac_0/dac_rst] [get_bd_ports dac_rst_o]
connect_bd_net [get_bd_pins dac_0/dac_sel] [get_bd_ports dac_sel_o]
connect_bd_net [get_bd_pins dac_0/dac_wrt] [get_bd_ports dac_wrt_o]
connect_bd_net [get_bd_pins dac_0/dac_dat] [get_bd_ports dac_dat_o]
connect_bd_net [get_bd_pins const_0/dout] [get_bd_pins dac_0/s_axis_tvalid]
connect_bd_net [get_bd_pins rst_0/peripheral_aresetn] \
  [get_bd_pins adc_ab/aresetn] [get_bd_pins marga/s0_axi_aresetn] [get_bd_pins ps_0_axi_periph/S00_ARESETN] \
  [get_bd_pins ps_0_axi_periph/M00_ARESETN] [get_bd_pins ps_0_axi_periph/ARESETN] [get_bd_pins rx_0/aresetn] \
  [get_bd_pins rx_1/aresetn] [get_bd_pins tx_0/aresetn]
connect_bd_net -net rx_aresetn_1 [get_bd_pins marga/rx0_rst_n_o] [get_bd_pins rx_0/rx_aresetn]
connect_bd_net -net rx_aresetn_2 [get_bd_pins marga/rx1_rst_n_o] [get_bd_pins rx_1/rx_aresetn]
connect_bd_net [get_bd_pins marga/leds_o] [get_bd_pins led_slice/Din]
connect_bd_net [get_bd_pins led_slice/Dout] [get_bd_pins led_concat/In0]
connect_bd_net [get_bd_pins led_concat/dout] [get_bd_ports led_o]
connect_bd_net [get_bd_pins marga/ocra1_clk_o] [get_bd_pins spi_concat_0/In0]
connect_bd_net [get_bd_pins marga/ocra1_syncn_o] [get_bd_pins spi_concat_0/In1]
connect_bd_net [get_bd_pins marga/ocra1_ldacn_o] [get_bd_pins spi_concat_0/In2]
connect_bd_net [get_bd_pins marga/ocra1_sdox_o] [get_bd_pins spi_concat_0/In3]
connect_bd_net [get_bd_pins marga/ocra1_sdoy_o] [get_bd_pins spi_concat_0/In4]
connect_bd_net [get_bd_pins marga/ocra1_sdoz_o] [get_bd_pins spi_concat_0/In5]
connect_bd_net [get_bd_pins marga/ocra1_sdoz2_o] [get_bd_pins spi_concat_0/In6]
connect_bd_net [get_bd_pins marga/trig_o] [get_bd_pins pio_concat_0/In2]
connect_bd_net [get_bd_pins marga/fhdo_clk_o] [get_bd_pins pio_concat_0/In3]
connect_bd_net [get_bd_pins marga/fhdo_ssn_o] [get_bd_pins pio_concat_0/In4]
connect_bd_net [get_bd_pins marga/fhdo_sdo_o] [get_bd_pins pio_concat_0/In5]
connect_bd_net [get_bd_pins spi_concat_0/dout] [get_bd_pins nio_concat_0/In0]
connect_bd_net [get_bd_pins marga/tx_gate_o] [get_bd_pins nio_concat_0/In1]
connect_bd_net [get_bd_ports exp_p_tri_i] [get_bd_pins marga/fhdo_sdi_i]
connect_bd_net [get_bd_pins nio_concat_0/dout] [get_bd_ports exp_n_tri_io]
connect_bd_net [get_bd_pins pio_concat_0/dout] [get_bd_ports exp_p_tri_io]
connect_bd_net [get_bd_ports trig_i] [get_bd_pins marga/trig_i]
connect_bd_net [get_bd_pins marga/rx_gate_o] [get_bd_ports rx_gate_o]

# ---- address map ----
assign_bd_address -offset 0x43C00000 -range 512K -target_address_space [get_bd_addr_spaces ps_0/Data] [get_bd_addr_segs marga/s0_axi/reg0]

validate_bd_design
save_bd_design
